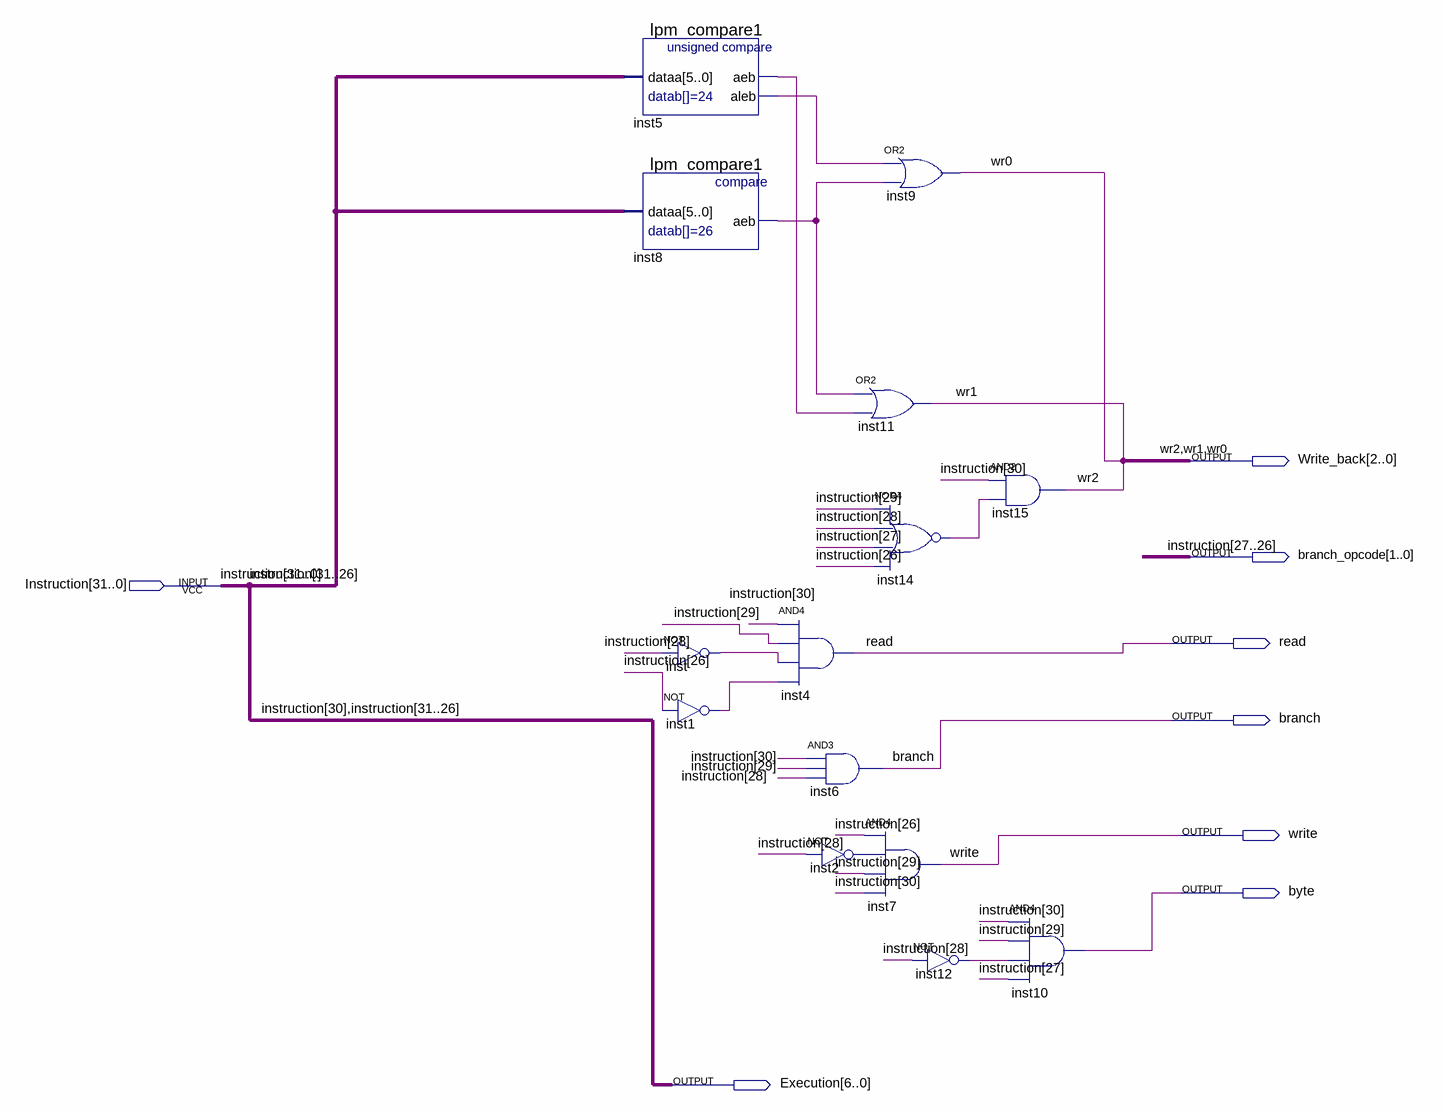
[diagram p0: schematic sheet]
// Quartus schematic controller.bdf as structural Verilog: 14 symbols, 8 pins
module controller (
  input  [31:0] Instruction,
  output [2:0] Write_back,
  output [1:0] branch_opcode,
  output read,
  output branch,
  output write,
  output \byte ,
  output [6:0] Execution
);

  wire inst1_out, inst2_out, inst5_aeb, inst5_aleb, inst8_aeb, inst12_out, inst14_out, inst_out;

  lpm_compare1 inst5 (.dataa(Instruction[31:26]), .aeb(inst5_aeb), .aleb(inst5_aleb));
  lpm_compare1 inst8 (.dataa(Instruction[31:26]), .aeb(inst8_aeb));
  not inst (inst_out, Instruction[28]);
  not inst1 (inst1_out, Instruction[26]);
  and inst4 (read, Instruction[30], Instruction[29], inst_out, inst1_out);
  or inst11 (Write_back[1], inst8_aeb, inst5_aeb);
  nor inst14 (inst14_out, Instruction[29], Instruction[28], Instruction[27], Instruction[26]);
  and inst6 (branch, Instruction[30], Instruction[29], Instruction[28]);
  and inst7 (write, Instruction[26], inst2_out, Instruction[29], Instruction[30]);
  not inst2 (inst2_out, Instruction[28]);
  or inst9 (Write_back[0], inst5_aleb, inst8_aeb);
  not inst12 (inst12_out, Instruction[28]);
  and inst15 (Write_back[2], Instruction[30], inst14_out);
  and inst10 (\byte , Instruction[30], Instruction[29], inst12_out, Instruction[27]);

  assign branch_opcode = Instruction[27:26];
  assign Execution = {Instruction[30], Instruction[31:26]};

  // Other names for the same wires on the sheet: wr0 = Write_back[0]; wr1 = Write_back[1]; wr2 = Write_back[2]
endmodule
